# Altium schematic sheet charging.schdoc: Charging
size 431 x 279 mm; DrawnBy: D. Bruey, M. Ciuffo; Organization: Synapse Product Development, LLC.; Address1: 1511 6th Ave., Suite 400; Address2: Seattle, Washington 98101; Address3: 206.381.0898; Address4: www.synapse.com; DocumentNumber: 13; SheetNumber: 5; SheetTotal: 7; PageSetup: Record=PageOptions|CenterHorizontal=True|CenterVertical=True|PrintScale=1.06|XCorrection=1.00|YCorrection=1.00|PrintKind=1|BorderSize=5000000|LeftOffset=0|BottomOffset=0|Orientation=2|PaperLength=4318|PaperWidth=2794|Scale=100|PaperSource=7|PrintQuality=200|MediaType=1|DitherType=10|PrintScaleMode=1|PaperKind=11x17|PaperIndex=3
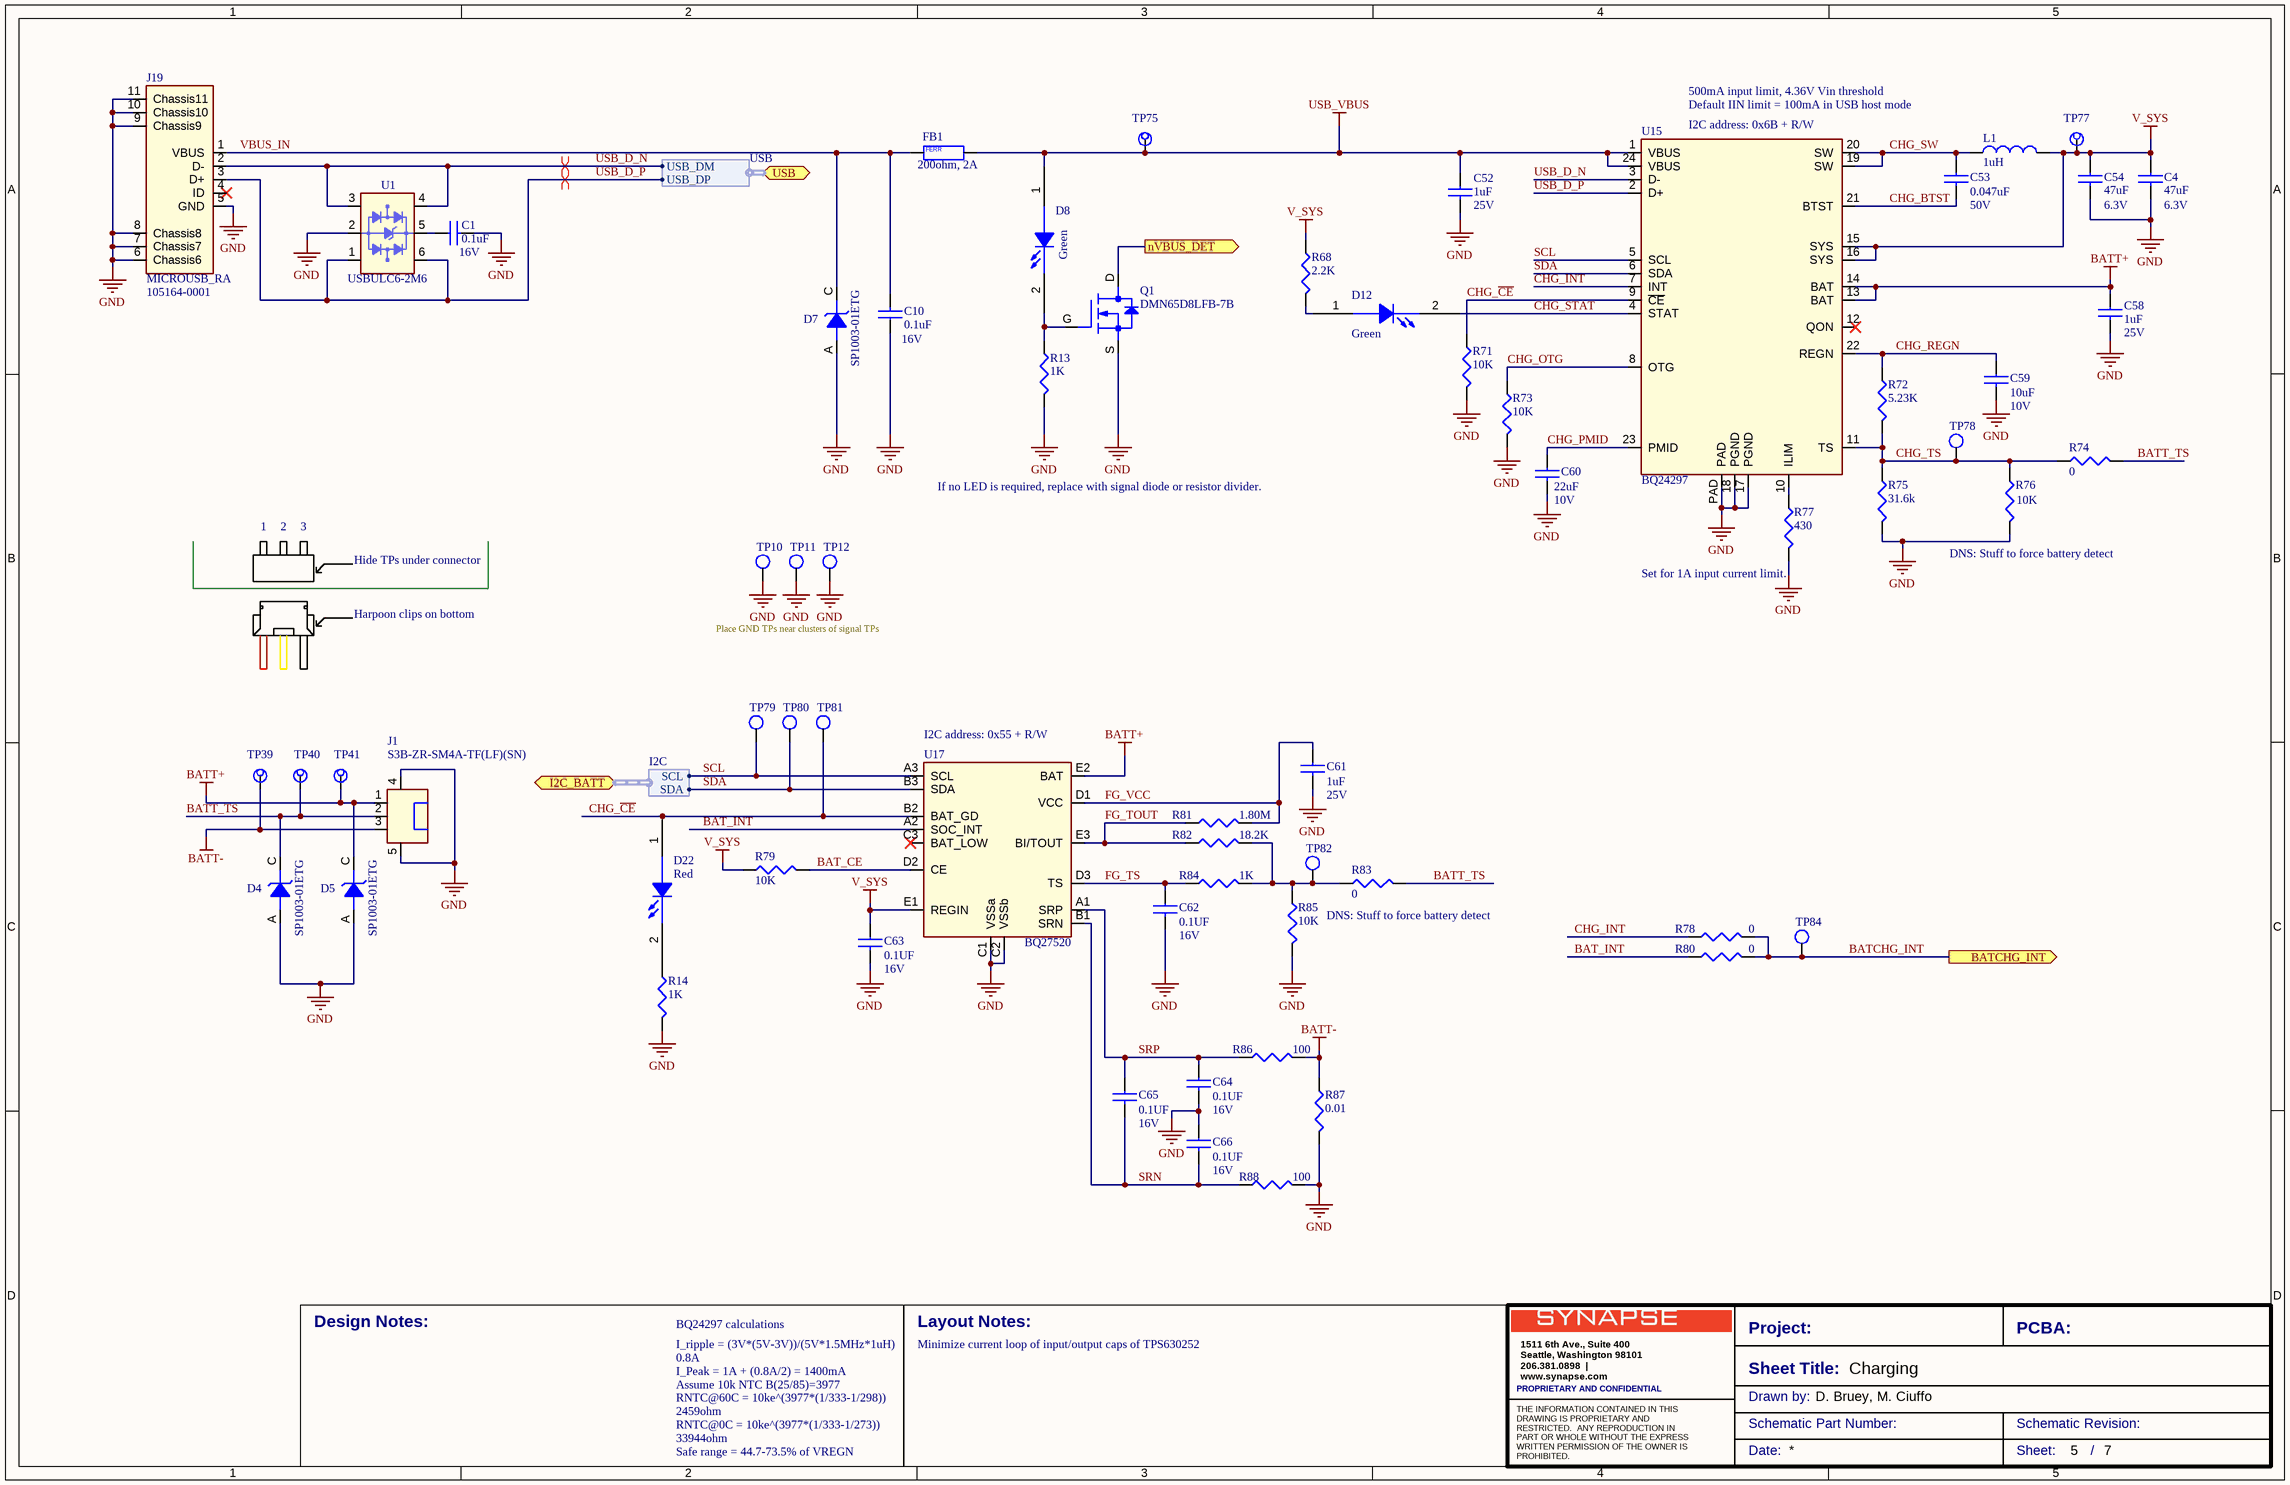
[diagram p0: charging.schdoc]

## Parts
C1  0.1uF  Voltage: 16V  [0402-IPCsm_55]
C4  47uF  Voltage: 6.3V  [0805-ipcsm_145]
C10  0.1uF  Voltage: 16V  [0402-IPCsm_55]
C52  1uF  Voltage: 25V  [0603-IPCsm_90]
C53  0.047uF  Voltage: 50V  [0402-IPCsm_55]
C54  47uF  Voltage: 6.3V  [0805-ipcsm_145]
C58  1uF  Voltage: 25V  [0603-IPCsm_90]
C59  10uF  Voltage: 10V  [0402-ipcsm_55]
C60  22uF  Voltage: 10V  [0805-IPCsm_100]
C61  1uF  Voltage: 25V  [0603-IPCsm_90]
C62  0.1UF  Voltage: 16V  [0603-ipcsm_90]
C63  0.1UF  Voltage: 16V  [0603-ipcsm_90]
C64  0.1UF  Voltage: 16V  [0603-ipcsm_90]
C65  0.1UF  Voltage: 16V  [0603-ipcsm_90]
C66  0.1UF  Voltage: 16V  [0603-ipcsm_90]
D4  SP1003-01ETG  [SOD882-60]
D5  SP1003-01ETG  [SOD882-60]
D7  SP1003-01ETG  [SOD882-60]
D8  Green  [led_ltst-c191kgkt_s80]
D12  Green  [led_ltst-c191kgkt_s80]
D22  Red  [LED_LTST-C191KGKT_S80]
FB1  200ohm, 2A  [ind-0603_38H]
J1  S3B-ZR-SM4A-TF(LF)(SN)  [CON_JST_S3B-ZR-SM4A]
J19  MICROUSB_RA  mfg_pn: 105164-0001  [CON_USB_MOLEX_105164-0001]
L1  1uH  [ind-1008_35H]
Q1  DMN65D8LFB-7B  [DFN3-1006_50H]
R13  1K  [0603-IPCsm_56]
R14  1K  [0603-IPCsm_56]
R68  2.2K  [0402-IPCsm_40]
R71  10K  [0402-IPCsm_40]
R72  5.23K  [0402-IPCsm_40]
R73  10K  [0402-IPCsm_40]
R74  0  [0402-IPCsm_40]
R75  31.6k  [0402-IPCsm_40]
R76  10K  [0402-IPCsm_40]
R77  430  [0402-IPCsm_40]
R78  0  [0402-IPCsm_40]
R79  10K  [0402-IPCsm_40]
R80  0  [0402-IPCsm_40]
R81  1.80M  [0603-IPCsm_56]
R82  18.2K  [0603-IPCsm_56]
R83  0  [0402-IPCsm_40]
R84  1K  [0603-IPCsm_56]
R85  10K  [0402-IPCsm_40]
R86  100  [0603-IPCsm_56]
R87  0.01  [r-0805_20H]
R88  100  [0603-IPCsm_56]
TP10  tp-1mm  [TP-S100_SMT]  (value not drawn)  (no BOM)
TP11  tp-1mm  [TP-S100_SMT]  (value not drawn)  (no BOM)
TP12  tp-1mm  [TP-S100_SMT]  (value not drawn)  (no BOM)
TP39  TPC150H080P  [TPC150H080P]  (value not drawn)  (no BOM)
TP40  TPC150H080P  [TPC150H080P]  (value not drawn)  (no BOM)
TP41  TPC150H080P  [TPC150H080P]  (value not drawn)  (no BOM)
TP75  TPC150H080P  [TPC150H080P]  (value not drawn)  (no BOM)
TP77  TPC150H080P  [TPC150H080P]  (value not drawn)  (no BOM)
TP78  tp-1mm  [TP-S100_SMT]  (value not drawn)  (no BOM)
TP79  tp-1mm  [TP-S100_SMT]  (value not drawn)  (no BOM)
TP80  tp-1mm  [TP-S100_SMT]  (value not drawn)  (no BOM)
TP81  tp-1mm  [TP-S100_SMT]  (value not drawn)  (no BOM)
TP82  tp-1mm  [TP-S100_SMT]  (value not drawn)  (no BOM)
TP84  tp-1mm  [TP-S100_SMT]  (value not drawn)  (no BOM)
U1  USBULC6-2M6  [UQFN6_ USBULC6-2M6]
U15  BQ24297  [QFN24_BQ24297RGE]
U17  BQ27520  [BGA15_BQ27520YZFR]

## Ports
BATCHG_INT (out), I2C_BATT (harness I2C), nVBUS_DET (out), USB (harness USB)

## Harnesses
USB: USB_DM, USB_DP
I2C: SCL, SDA

## Nets
BATT+: C58.1 D5.C J1.1 TP41.1(TP) U15.13(BAT) U15.14(BAT) U17.E2(BAT)
BATT-: J1.3 R86.2 R87.1 TP39.1(TP)
GND: C1.2 C4.2 C10.1 C52.2 C54.2 C58.2 C59.2 C60.2 C61.2 C62.2 C63.2 C64.2 C66.1 D4.A D5.A D7.A J1.4(TAB1) J1.5(TAB2) J19.5(GND) J19.6(Chassis6) J19.7(Chassis7) J19.8(Chassis8) J19.9(Chassis9) J19.10(Chassis10) J19.11(Chassis11) Q1.S R13.2 R14.2 R71.2 R73.2 R75.2 R76.2 R77.2 R85.2 R87.2 R88.2 TP10.1(TP) TP11.1(TP) TP12.1(TP) U1.2(GND) U15.17(PGND) U15.18(PGND) U15.PAD U17.C1(VSSa) U17.C2(VSSb)
USB_VBUS: C52.1 D8.1(A) FB1.1(ENDA) TP75.1(TP) U15.1(VBUS) U15.24(VBUS)
V_SYS: C4.1 C54.1 C63.1 L1.2 R68.1 R79.1 TP77.1(TP) U15.15(SYS) U15.16(SYS) U17.E1(REGIN)
BAT_CE: R79.2 U17.D2(CE)
BAT_INT: R80.1 U17.A2(SOC_INT)
BATCHG_INT: R78.2 R80.2 TP84.1(TP) ; port BATCHG_INT
BATT_TS: D4.C J1.2 R74.2 R83.2 TP40.1(TP)
CHG_BTST: C53.2 U15.21(BTST)
CHG_~{CE}: D22.1(A) R71.1 TP81.1(TP) U15.9(~{CE}) U17.B2(BAT_GD)
CHG_INT: R78.1 U15.7(INT)
CHG_OTG: R73.1 U15.8(OTG)
CHG_PMID: C60.1 U15.23(PMID)
CHG_REGN: C59.1 R72.1 U15.22(REGN)
CHG_STAT: D12.2(C) U15.4(STAT)
CHG_SW: C53.1 L1.1 U15.19(SW) U15.20(SW)
CHG_TS: R72.2 R74.1 R75.1 R76.1 TP78.1(TP) U15.11(TS)
FG_TOUT: R81.2 R82.2 U17.E3(BI/TOUT)
FG_TS: C62.1 R84.1 U17.D3(TS)
FG_VCC: C61.1 R81.1 U17.D1(VCC)
nVBUS_DET: Q1.D ; port nVBUS_DET
SCL: TP79.1(TP) U15.5(SCL) U17.A3(SCL) ; port I2C_BATT.SCL
SDA: TP80.1(TP) U15.6(SDA) U17.B3(SDA) ; port I2C_BATT.SDA
SRN: C65.2 C66.2 R88.1 U17.B1(SRN)
SRP: C64.1 C65.1 R86.1 U17.A1(SRP)
USB_D_N: J19.2(D-) U1.3(I/O2) U1.4(I/O3) U15.3(D-) ; port USB.USB_DM
USB_D_P: J19.3(D+) U1.1(I/O1) U1.6(I/O4) U15.2(D+) ; port USB.USB_DP
VBUS_IN: C10.2 D7.C FB1.2(ENDB) J19.1(VBUS)
NetC1_1: C1.1 U1.5(VDD)
NetD8_2: D8.2(C) Q1.G R13.1
NetD12_1: D12.1(A) R68.2
NetD22_2: D22.2(C) R14.1
NetR77_1: R77.1 U15.10(ILIM)
NetR82_1: R82.1 R83.1 R84.2 R85.1 TP82.1(TP)

Not connected (* = marked no-connect by the designer): J19 4(ID)*; U15 12(QON)*; U17 C3(BAT_LOW)*

## Layout directives
differential pair: USB_D_N, USB_D_P

## Notes on the sheet
- 500mA input limit, 4.36V Vin threshold
- Default IIN limit = 100mA in USB host mode
- (near U15) I2C address: 0x6B + R/W
- If no LED is required, replace with signal diode or resistor divider.
- 1
- 2
- 3
- Hide TPs under connector
- (near R76) DNS: Stuff to force battery detect
- Harpoon clips on bottom
- Place GND TPs near clusters of signal TPs
- (near R77) Set for 1A input current limit.
- (near U17) I2C address: 0x55 + R/W
- DNS: Stuff to force battery detect
- BQ24297 calculations
- I_ripple = (3V*(5V-3V))/(5V*1.5MHz*1uH)
- 0.8A
- I_Peak = 1A + (0.8A/2) = 1400mA
- Minimize current loop of input/output caps of TPS630252
- Assume 10k NTC B(25/85)=3977
- 2459ohm
- RNTC@60C = 10ke^(3977*(1/333-1/298))
- RNTC@0C = 10ke^(3977*(1/333-1/273))
- 33944ohm
- Safe range = 44.7-73.5% of VREGN
- Design Notes:
- Layout Notes:
- Project:
- Sheet Title:
- PCBA:
- PROPRIETARY AND CONFIDENTIAL
- Drawn by:
- Schematic Part Number:
- Schematic Revision:
- Date:
- Sheet:
- /
- (in symbol MPZ1608S221A) FERR

## Library data of the parts
C1 C10 = GRM155R71C104KA88D: CAP CER .1UF 16V X7R 0402; part_type: capacitor; id: 588; mfg: MURATA; dist: DIGIKEY; dist_pn: 490-3261-1-ND; source_package: C_0P1U_16V_X7R_0402; tolerance: 10%; TableName: viewAltiumCapacitors; mfg_pn: GRM155R71C104KA88D; type: X7R; height: 0.55MM; status: Unknown
C4 C54 = C2012X5R0J476M125AC: CAP CER 47UF 6.3V 20% X5R 0805; part_type: capacitor; id: 1352; mfg: TDK; dist: DIGIKEY; dist_pn: 445-8239-1-ND; TableName: viewAltiumCapacitors; mfg_pn: C2012X5R0J476M125AC; tolerance: 20%; height: 1.45MM; status: Unknown
C52 C58 C61 = GRM188R61E105KA12D: CAP CER 1UF 25V 10% X5R 0603; part_type: capacitor; id: 563; mfg: Murata; dist: Digikey; dist_pn: 490-3897-1-ND; TableName: viewAltiumCapacitors; mfg_pn: GRM188R61E105KA12D; type: X5R; tolerance: 10%; height: 0.9MM; status: Good
C53 = C1005X7R1H473K050BB: CAP CER 0.047UF 50V 10% X7R 0402; part_type: capacitor; id: 1196; mfg: TDK; dist: DIGIKEY; dist_pn: 445-7336-1-ND; TableName: viewAltiumCapacitors; mfg_pn: C1005X7R1H473K050BB; type: X7R; tolerance: 10%; height: 0.55MM; status: Unknown
C59 = CL05A106MP5NUNC: CAP CER 10UF 10V 20% X5R 0402; part_type: capacitor; id: 1055; mfg: Samsung Electro-Mechanics America, Inc; dist: DIGIKEY; dist_pn: 1276-1450-6-ND; source_package: C_10uF_10V_X5R_0402; TableName: viewAltiumCapacitors; mfg_pn: CL05A106MP5NUNC; type: X5R; tolerance: 20%; height: 0.55mm; status: Unknown
C60 = C2012JB1A226M085AC: CAP CER 22UF 10V 20% JB 0805; part_type: capacitor; id: 1097; mfg: TDK; dist: DIGIKEY; dist_pn: 445-11411-1-ND; source_package: C_22u_10V_JB_0805; TableName: viewAltiumCapacitors; mfg_pn: C2012JB1A226M085AC; type: JB; tolerance: 20%; height: 1.00MM; status: Unknown
C62-C66 = C0603C104J4RACTU: CAP CER 0.1UF 16V 5% X7R 0603; part_type: capacitor; id: 1053; mfg: Kemet; dist: Digi-Key; dist_pn: 399-1097-1-ND; source_package: C_0U1_16V_X7R_0603; TableName: viewAltiumCapacitors; mfg_pn: C0603C104J4RACTU; type: X7R; height: 0.87MM; status: Unknown; tolerance: 5%
D4 D5 D7 = SP1003-01ETG: TVS DIODE 5VWM 12VC SOD882; id: 1282; mfg: Littelfuse Inc.; dist: Digikey; dist_pn: F4088CT-ND; TableName: viewAltiumDiscretes; mfg_pn: SP1003-01ETG; part_type: tvs; type: TVS; height: 0.60mm; status: Unknown
D8 D12 = LTST-C191KGKT: LED GREEN CLEAR THIN 0603 SMD; part_type: Discretes; id: 1137; mfg: Lite-On Inc; dist: Digikey; dist_pn: 160-1446-1-ND; voltage: 3.2V; current: 20mA; TableName: viewAltiumDiscretes; layout_notes: symbol now has A/C pins instead of 1/2, check footprint accordingly.; mfg_pn: LTST-C191KGKT; source_package: LTST-C191KGKT; status: Good; height: 0.55mm; type: LED
D22 = LTST-C191KRKT: LED RED CLEAR 0603 SMD; part_type: Discretes; id: 1235; mfg: Lite-On Inc; dist: Digikey; dist_pn: 160-1447-1-ND; voltage: 2V; current: 20mA; TableName: viewAltiumDiscretes; layout_notes: symbol now has A/C pins instead of 1/2, check footprint accordingly.; mfg_pn: LTST-C191KRKT; source_package: LTST-C191KRKT; type: LED; height: 0.55mm; status: Unknown
FB1 = MPZ1608S221A: FERRITE CHIP 220 OHM 2A 0603; part_type: ferrite_bead; id: 462; mfg: TDK Corporation; dist: Digikey; dist_pn: 445-1565-1-ND; source_package: BLM18PG300SN1D; TableName: viewAltiumInductors; mfg_pn: MPZ1608S221A; height: 0.8MM; status: Unknown
J1 = S3B-ZR-SM4A-TF(LF)(SN): 3 Positions Header, Shrouded Connector 0.059" (1.50mm) Surface Mount, Right Angle Tin; id: 1655; mfg: JST Sales America Inc; dist: DIGIKEY; dist_pn: 455-1694-2-ND; positions: 3; TableName: viewAltiumConnectors; mfg_pn: S3B-ZR-SM4A-TF(LF)(SN); part_type: connector; height: 3.7mm; status: Unknown
J19 = 105164-0001: USB - micro B Receptacle Connector 5 Position Surface Mount, Right Angle, Horizontal; id: 1627; mfg: MOLEX; dist: DIGIKEY; dist_pn: WM11263CT-ND; positions: 5; TableName: viewAltiumConnectors; part_type: usb; source_package: USB_MICRO; status: Unknown; datasheet: http://www.molex.com/pdm_docs/sd/1051640001_sd.pdf
L1 = LQM2HPN1R0MG0L: INDUCTOR 1.0UH 20% 1600MA 1008; id: 437; mfg: MURATA; dist: DIGIKEY; dist_pn: 490-5112-1-ND; TableName: viewAltiumInductors; mfg_pn: LQM2HPN1R0MG0L; part_type: inductor; height: 0.80MM; status: Unknown; Tolerance: 20%
Q1 = DMN65D8LFB-7B: MOSFET N-CH 60V 260MA 3DFN; part_type: fet; id: 1268; mfg: Diodes; dist: Digikey; dist_pn: DMN65D8LFB-7BDICT-ND; type: NFET; TableName: viewAltiumDiscretes; mfg_pn: DMN65D8LFB-7B; voltage: 60V; current: 260mA; status: Unknown
R13 R14 R84 = RC0603FR-071KL: RES 1K 1/10W 1% 0603 SMD; part_type: resistor; Tolerance: 1.00%; Voltage: 50V; DIST: Digikey; MFG: Yageo; DIST_PN: 311-1.00KHRTR-ND; Power: 0.1W; id: 1277; source_package: R_1K_0.1P_0603; TableName: viewAltiumResistors; Type: "; Height: 0.5MM; MFG_PN: RC0603FR-071KL; status: Unknown
R68 = ERJ-2GEJ222X: RES SMD 2.2K OHM 5% 1/10W 0402; part_type: resistor; Tolerance: 5.00%; Voltage: 50V; DIST: DIGIKEY; MFG: PANASONIC; DIST_PN: P2.2KJCT-ND; Power: 0.1W; id: 1545; source_package: R_2P2K_5P_0402; TableName: viewAltiumResistors; Height: .4MM; MFG_PN: ERJ-2GEJ222X; status: Unknown
R71 R73 R76 R79 R85 = ERJ-2GEJ103X: RES 10K OHM 1/10W 5% 0402 SMD; part_type: resistor; DIST: Digikey; MFG: Panasonic; DIST_PN: P10KJCT-ND; id: 2252; source_package: R_10K_5P_0402; TableName: viewAltiumResistors; Tolerance: 5%; Height: 0.4mm; MFG_PN: ERJ-2GEJ103X; status: Unknown
R72 = ERJ-2RKF5231X: RES 5.23K OHM 1/10W 1% 0402 SMD; part_type: resistor; Tolerance: 1.00%; DIST: DIGIKEY; MFG: PANASONIC; DIST_PN: P5.23KLCT-ND; Power: 0.1W; id: 1680; TableName: viewAltiumResistors; Height: .35MM; MFG_PN: ERJ-2RKF5231X; source_package: RES; status: Unknown
R74 R78 R80 R83 = ERJ-2GE0R00X: RES 0.0 OHM 1/10W JUMP 0402 SMD; part_type: resistor; Tolerance: 5.00%; DIST: DIGIKEY; MFG: PANASONIC; DIST_PN: P0.0JDKR-ND; Power: 0.063W; id: 1129; source_package: R_0_5P_0402; TableName: viewAltiumResistors; Height: 0.4MM; MFG_PN: ERJ-2GE0R00X; status: Unknown
R75 = ERJ-2RKF3162X: RES 31.6K OHM 0.1W 1% 0402 SMD; part_type: resistor; Tolerance: 1.00%; DIST: DIGIKEY; MFG: PANASONIC; DIST_PN: P31.6KLCT-ND; id: 2198; source_package: R_10K_1P_0402; TableName: viewAltiumResistors; Height: 0.4mm; MFG_PN: ERJ-2RKF3162X; Power: 0.1W; status: Unknown
R77 = ERJ-2RKF4300X: RES 430 OHM 1/10W 1% 0402 SMD; part_type: resistor; Tolerance: 1.00%; DIST: DIGIKEY; MFG: PANASONIC; DIST_PN: P430LCT-ND; Power: 0.063W; id: 2096; source_package: R_430_1P_0402; TableName: viewAltiumResistors; Height: 0.4mm; MFG_PN: ERJ-2RKF4300X; status: Unknown
R81 = ERJ-3EKF1804V: RES 1.80M OHM 1/10W 1% 0603 SMD; part_type: resistor; Tolerance: 1.00%; DIST: DIGIKEY; MFG: PANASONIC; DIST_PN: P1.80MHCT-ND; Power: 0.1W; id: 1978; source_package: R_1M80_1P_0603; TableName: viewAltiumResistors; Height: .55MM; MFG_PN: ERJ-3EKF1804V; status: Unknown
R82 = ERJ-3EKF1822V: RES 18.2K OHM 1/10W 1% 0603 SMD; part_type: resistor; Tolerance: 1.00%; DIST: DIGIKEY; MFG: PANASONIC; DIST_PN: P18.2KHCT-ND; Power: 0.1W; id: 2069; source_package: R_1K_1P_0603; TableName: viewAltiumResistors; Height: .55MM; MFG_PN: ERJ-3EKF1822V; status: Unknown
R86 R88 = ERJ-3GEYJ101V: RES 100 OHM 1/10W 5% 0603 SMD; part_type: resistor; Tolerance: 5.00%; DIST: DIGIKEY; MFG: PANASONIC; DIST_PN: P100GCT-ND; id: 1685; source_package: R_100_0603_1P; TableName: viewAltiumResistors; Height: .55MM; MFG_PN: ERJ-3GEYJ101V; status: Unknown
R87 = PMR10EZPFU10L0: RES 0.01 OHM 1/2W 1% 0805 SMD; part_type: resistor; DIST: DIGIKEY; MFG: Rohm Semiconductor; DIST_PN: RHM.010AJCT-ND; Power: 0.5W; id: 2182; source_package: R_ 0.01_0.1P_0805; TableName: viewAltiumResistors; Tolerance: 1%; Height: 0.43MM; MFG_PN: PMR10EZPFU10L0; status: Unknown
TP10-TP12 TP78-TP82 TP84 = TP0042: TESTPOINT, 1MM SMD, Square pad, Round SM opening; part_type: test_point; mfg_pn: TP0042; mfg: NA; id: 888; TableName: viewAltiumMisc; dist: NA; dist_pn: NA; source_package: tp_smt; status: Unknown
TP39-TP41 TP75 TP77 = TPC150H080P: TESTPOINT, 1.5mm pad, 0.8 mm plated; part_type: test_point; id: 1236; mfg: NA; TableName: viewAltiumMisc; mfg_pn: TPC150H080P; dist: NA; dist_pn: NA; source_package: TPC150H080P; height: .05MM; status: Unknown
U1 = USBULC6-2M6: TVS DIODE 5VWM 17VC 6VFQFPN; part_type: ic; id: 2369; mfg: ST; dist: Digi-Key; dist_pn: 497-7044-1-ND; TableName: viewAltiumIcs; mfg_pn: USBULC6-2M6; source_package: USBULC6-2M6; height: 0.6mm; status: Good
U15 = BQ24297RGET: IC LI+ CHARGER PWR MGMT 24VQFN; id: 2425; mfg: TI; dist: Digikey; dist_pn: 296-39580-1-ND; TableName: viewAltiumIcs; mfg_pn: BQ24297RGET; part_type: ic; source_package: BQ24297; height: 1mm; status: Unknown; datasheet: http://www.ti.com/lit/ds/symlink/bq24297.pdf
U17 = BQ27520YZFR-G4: IC BATT FUEL GAUGE LIION 15DSBGA; id: 2402; mfg: TI; dist: Digikey; dist_pn: 296-38882-1-ND; TableName: viewAltiumIcs; mfg_pn: BQ27520YZFR-G4; part_type: ic; source_package: BQ27520YZFR-G4; height: .625mm; status: Unknown; datasheet: http://www.ti.com/lit/ds/symlink/bq27520-g4.pdf